# EAGLE design damp_v0002 (EAGLE 6.4)

## Sheet 1 of 2: DAC
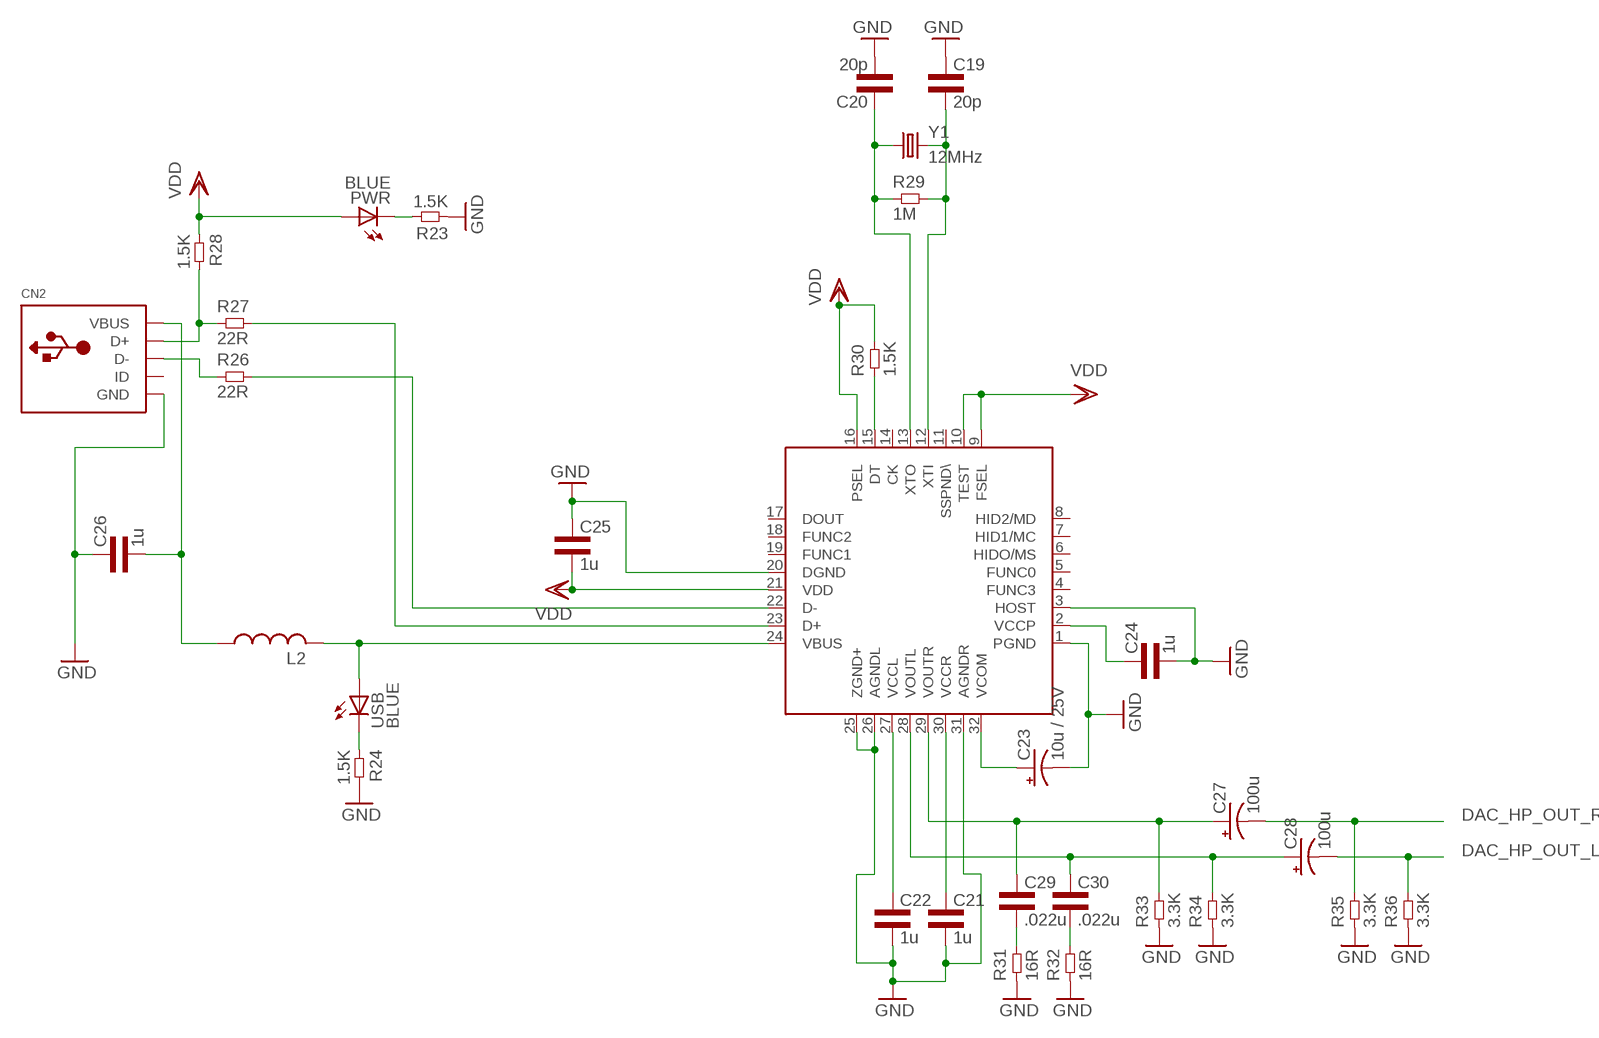
[diagram p0: schematic, sheet 1]

### Parts
C19  20p  CAP0603L3  [0603L3]
C20  20p  CAP0603L3  [0603L3]
C21  1u  CAP0603L3  [0603L3]
C22  1u  CAP0603L3  [0603L3]
C23  10u / 25V  CPOL-USE1.8-4  [E1,8-4]
C24  1u  CAP0603L3  [0603L3]
C25  1u  CAP0603L3  [0603L3]
C26  1u  CAP0603L3  [0603L3]
C27  100u  CPOL-USE2-5  [E2-5]
C28  100u  CPOL-USE2-5  [E2-5]
C29  .022u  CAP0603L3  [0603L3]
C30  .022u  CAP0603L3  [0603L3]
CN2  USBMINIB  [USB-MINIB]
L2  RCL_L-USL3225M  [RCL_L3225M]
PWR  BLUE  LED-BLUE0603  [LED-0603]
R23  1.5K  RES0603L3  [0603L3]
R24  1.5K  RES0603L3  [0603L3]
R26  22R  RES0603L3  [0603L3]
R27  22R  RES0603L3  [0603L3]
R28  1.5K  RES0603L3  [0603L3]
R29  1M  RES0603L3  [0603L3]
R30  1.5K  RES0603L3  [0603L3]
R31  16R  RES0603L3  [0603L3]
R32  16R  RES0603L3  [0603L3]
R33  3.3K  RES0603L3  [0603L3]
R34  3.3K  RES0603L3  [0603L3]
R35  3.3K  RES0603L3  [0603L3]
R36  3.3K  RES0603L3  [0603L3]
U$1  PCM2707_V1_PCM2704C_PCM2707  [PCM2707_V1_PCM2704C_PCM2707]
USB  BLUE  LED-BLUE0603  [LED-0603]
Y1  12MHz  CRYSTALHC49US  [HC49US]

### Nets
DAC_HP_OUT_L: C28.- R36.P$2 ; also sheet 2
DAC_HP_OUT_R: C27.- R35.P$2 ; also sheet 2
GND: C19.P$1 C20.P$2 C21.P$2 C22.P$2 C23.- C24.P$2 C25.P$1 C26.P$1 CN2.GND R23.P$1 R24.P$2 R31.P$1 R32.P$1 R33.P$1 R34.P$1 R35.P$1 R36.P$1 U$1.1(PGND) U$1.3(HOST) U$1.20(DGND) U$1.25(ZGND+) U$1.26(AGNDL) U$1.31(AGNDR) ; also sheet 2
N$2: PWR.C R23.P$2
N$6: R24.P$1 USB.C
N$18: CN2.D+ R27.P$1 R28.P$2
N$21: CN2.D- R26.P$1
N$37: R27.P$2 U$1.23(D+)
N$42: R26.P$2 U$1.22(D-)
N$43: C20.P$1 R29.P$1 U$1.13(XTO) Y1.1
N$44: C19.P$2 R29.P$2 U$1.12(XTI) Y1.2
N$45: C22.P$1 U$1.27(VCCL)
N$50: C21.P$1 U$1.30(VCCR)
N$51: C23.+ U$1.32(VCOM)
N$52: C29.P$2 R31.P$2
N$53: C24.P$1 U$1.2(VCCP)
N$54: C27.+ C29.P$1 R33.P$2 U$1.29(VOUTR)
N$55: L2.2 U$1.24(VBUS) USB.A
N$56: C26.P$2 CN2.VBUS L2.1
N$57: C28.+ C30.P$1 R34.P$2 U$1.28(VOUTL)
N$58: R30.P$1 U$1.15(DT)
N$59: C30.P$2 R32.P$2
VDD: C25.P$2 PWR.A R28.P$1 R30.P$2 U$1.9(FSEL) U$1.10(TEST) U$1.16(PSEL) U$1.21(VDD)
Unconnected: CN2.ID U$1.4(FUNC3) U$1.5(FUNC0) U$1.6(HIDO/MS) U$1.7(HID1/MC) U$1.8(HID2/MD) U$1.11(SSPND\) U$1.14(CK) U$1.17(DOUT) U$1.18(FUNC2) U$1.19(FUNC1)

## Sheet 2 of 2: Amp
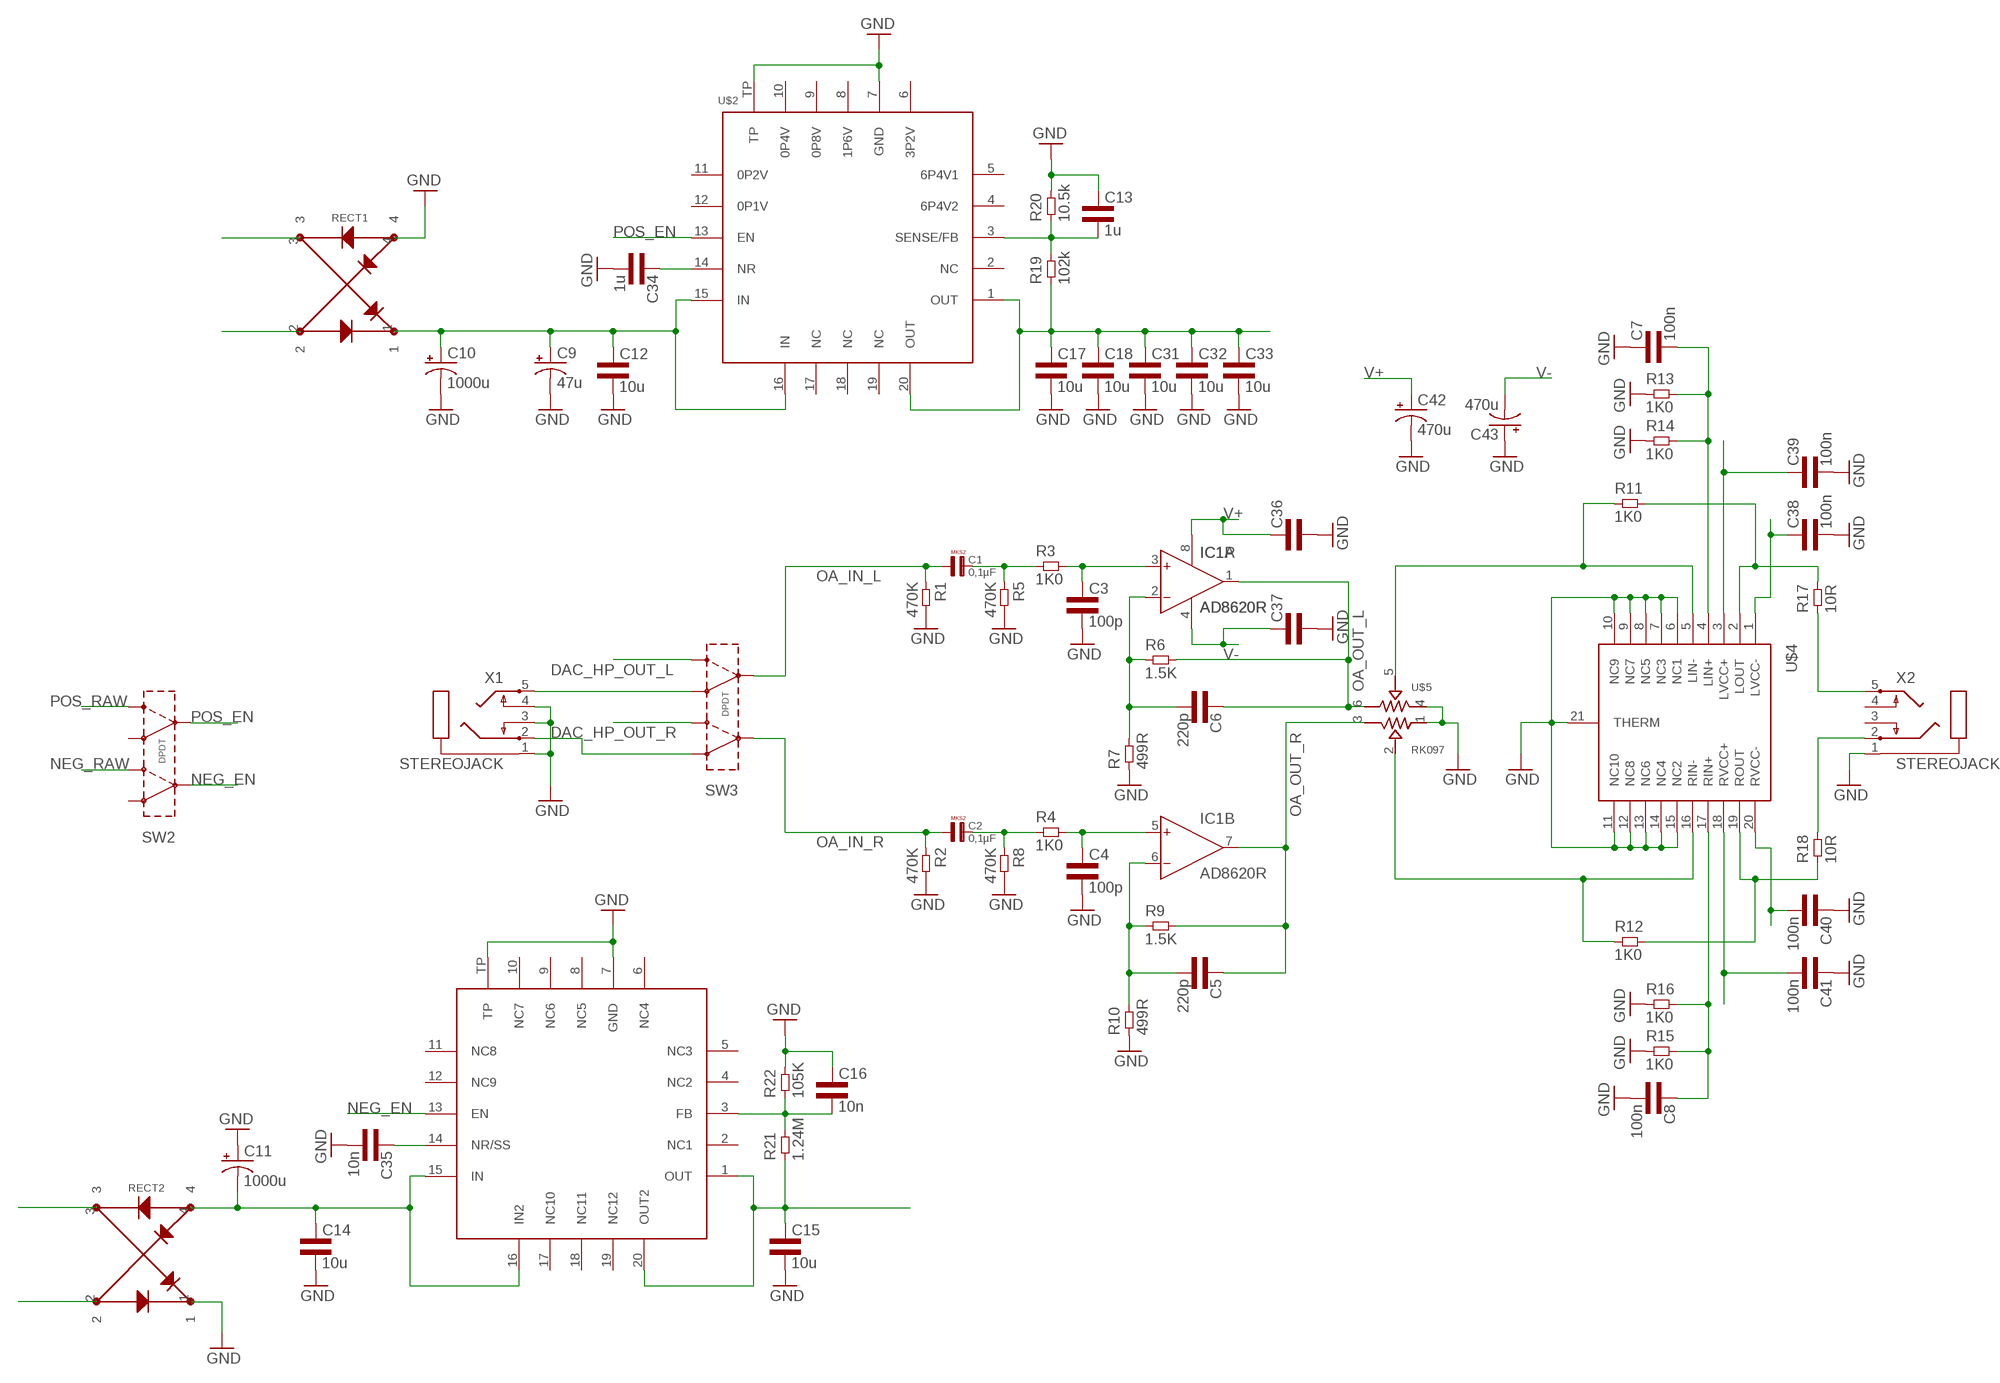
[diagram p1: schematic, sheet 2]

### Parts
C1  0,1µF  [R5B2K5]
C2  0,1µF  [R5B2K5]
C3  100p  CAP0603L3  [0603L3]
C4  100p  CAP0603L3  [0603L3]
C5  220p  CAP0603L3  [0603L3]
C6  220p  CAP0603L3  [0603L3]
C7  100n  CAP0603L3  [0603L3]
C8  100n  CAP0603L3  [0603L3]
C9  47u  CPOL-USCT7343  [CT7343]
C10  1000u  CPOL-USE7.5-16  [E7,5-16]
C11  1000u  CPOL-USE7.5-16  [E7,5-16]
C12  10u  CAP0805L3  [0805L3]
C13  1u  CAP0603L3  [0603L3]
C14  10u  CAP0805L3  [0805L3]
C15  10u  CAP0805L3  [0805L3]
C16  10n  CAP0603L3  [0603L3]
C17  10u  CAP0805L3  [0805L3]
C18  10u  CAP0805L3  [0805L3]
C31  10u  CAP0805L3  [0805L3]
C32  10u  CAP0805L3  [0805L3]
C33  10u  CAP0805L3  [0805L3]
C34  1u  CAP0603L3  [0603L3]
C35  10n  CAP0603L3  [0603L3]
C36  CAP0603L3  [0603L3]
C37  CAP0603L3  [0603L3]
C38  100n  CAP0603L3  [0603L3]
C39  100n  CAP0603L3  [0603L3]
C40  100n  CAP0603L3  [0603L3]
C41  100n  CAP0603L3  [0603L3]
C42  470u  CPOL-USE5-10.5  [E5-10,5]
C43  470u  CPOL-USE5-10.5  [E5-10,5]
IC1  AD8620R  [SO8]
R1  470K  RES0603L3  [0603L3]
R2  470K  RES0603L3  [0603L3]
R3  1K0  RES0603L3  [0603L3]
R4  1K0  RES0603L3  [0603L3]
R5  470K  RES0603L3  [0603L3]
R6  1.5K  RES0603L3  [0603L3]
R7  499R  RES0603L3  [0603L3]
R8  470K  RES0603L3  [0603L3]
R9  1.5K  RES0603L3  [0603L3]
R10  499R  RES0603L3  [0603L3]
R11  1K0  RES0603L3  [0603L3]
R12  1K0  RES0603L3  [0603L3]
R13  1K0  RES0603L3  [0603L3]
R14  1K0  RES0603L3  [0603L3]
R15  1K0  RES0603L3  [0603L3]
R16  1K0  RES0603L3  [0603L3]
R17  10R  RES1206L3  [1206L3]
R18  10R  RES1206L3  [1206L3]
R19  102k  RES0603L3  [0603L3]
R20  10.5k  RES0603L3  [0603L3]
R21  1.24M  RES0603L3  [0603L3]
R22  105K  RES0603L3  [0603L3]
RECT1  RECTIFIER_Z4GP206  [RECTIFIER_ABS-4]
RECT2  RECTIFIER_Z4GP206  [RECTIFIER_ABS-4]
SW2  DPDTCAS-A  [CAS-A]
SW3  DPDTCAS-A  [CAS-A]
U$2  POWER-SUPPLY_POS_V1_TI_LDO_TPS7A4700  [POWER-SUPPLY_POS_V1_TI_LDO_VQFN-20]
U$3  POWER-SUPPLY_POS_V1_TI_LDO_TPS7A3301RGWT  [POWER-SUPPLY_POS_V1_TI_LDO_VQFN-20]
U$4  PCM2707_V1_AMP_TPA6120_TPA6120  [PCM2707_V1_AMP_TPA6120_TPA6120]
U$5  RK097  [RK097]
X1  STEREOJACK  [STX3100]
X2  STEREOJACK  [STX3100]

### Nets
AC1: RECT1.3
AC2: RECT1.2
AC3: RECT2.3
AC4: RECT2.2
DAC_HP_OUT_L: SW3.P$6(OUTB2) ; also sheet 1
DAC_HP_OUT_R: SW3.P$3(OUTA2) ; also sheet 1
GND: C3.P$2 C4.P$2 C7.P$1 C8.P$2 C9.- C10.- C11.+ C12.2 C13.P$1 C14.2 C15.2 C16.P$1 C17.2 C18.2 C31.2 C32.2 C33.2 C34.P$2 C35.P$2 C36.P$2 C37.P$2 C38.P$2 C39.P$2 C40.P$1 C41.P$1 C42.- C43.+ R1.P$2 R2.P$2 R5.P$2 R7.P$1 R8.P$2 R10.P$1 R13.P$1 R14.P$1 R15.P$1 R16.P$1 R20.P$2 R22.P$2 RECT1.4 RECT2.1 U$2.7(GND) U$2.TP U$3.7(GND) U$3.TP U$4.6(NC1) U$4.7(NC3) U$4.8(NC5) U$4.9(NC7) U$4.10(NC9) U$4.11(NC10) U$4.12(NC8) U$4.13(NC6) U$4.14(NC4) U$4.15(NC2) U$4.21(THERM) U$5.1 U$5.4 X1.1 X1.3 X1.4 X2.1 ; also sheet 1
N$1: SW3.P$4(OUTB1) X1.5
N$3: SW3.P$1(OUTA1) X1.2
N$4: C34.P$1 U$2.14(NR)
N$7: C1.2 R3.P$1 R5.P$1
N$8: C3.P$1 IC1.3(A:IN+) R3.P$2
N$9: C6.P$2 IC1.2(A:IN-) R6.P$1 R7.P$2
N$10: R11.P$1 U$4.5(LIN-) U$5.5
N$11: R12.P$1 U$4.16(RIN-) U$5.2
N$12: C2.2 R4.P$1 R8.P$1
N$13: C4.P$1 IC1.5(B:IN+) R4.P$2
N$14: R11.P$2 R17.2 U$4.2(LOUT)
N$15: C5.P$2 IC1.6(B:IN-) R9.P$1 R10.P$2
N$16: R12.P$2 R18.1 U$4.19(ROUT)
N$17: C7.P$2 R13.P$2 R14.P$2 U$4.4(LIN+)
N$19: C8.P$1 R15.P$2 R16.P$2 U$4.17(RIN+)
N$20: R17.1 X2.5
N$22: R18.2 X2.2
N$23: C13.P$2 R19.P$2 R20.P$1 U$2.3(SENSE/FB)
N$24: C16.P$2 R21.P$2 R22.P$1 U$3.3(FB)
N$25: C35.P$1 U$3.14(NR/SS)
NEG_EN: SW2.P$2(INA) U$3.13(EN)
NEG_RAW: C11.- C14.1 RECT2.4 SW2.P$3(OUTA2) U$3.15(IN) U$3.16(IN2)
OA_IN_L: C1.1 R1.P$1 SW3.P$5(INB)
OA_IN_R: C2.1 R2.P$1 SW3.P$2(INA)
OA_OUT_L: C6.P$1 IC1.1(A:OUT) R6.P$2 U$5.6
OA_OUT_R: C5.P$1 IC1.7(B:OUT) R9.P$2 U$5.3
POS_EN: SW2.P$5(INB) U$2.13(EN)
POS_RAW: C9.+ C10.+ C12.1 RECT1.1 SW2.P$6(OUTB2) U$2.15(IN) U$2.16(IN)
V+: C17.1 C18.1 C31.1 C32.1 C33.1 C36.P$1 C39.P$1 C41.P$2 C42.+ IC1.8(P:V+) R19.P$1 U$2.1(OUT) U$2.20(OUT) U$4.3(LVCC+) U$4.18(RVCC+)
V-: C15.1 C37.P$1 C38.P$1 C40.P$2 C43.- IC1.4(P:V-) R21.P$1 U$3.1(OUT) U$3.20(OUT2) U$4.1(LVCC-) U$4.20(RVCC-)
Unconnected: SW2.P$1(OUTA1) SW2.P$4(OUTB1) U$2.2(NC) U$2.4(6P4V2) U$2.5(6P4V1) U$2.6(3P2V) U$2.8(1P6V) U$2.9(0P8V) U$2.10(0P4V) U$2.11(0P2V) U$2.12(0P1V) U$2.17(NC) U$2.18(NC) U$2.19(NC) U$3.2(NC1) U$3.4(NC2) U$3.5(NC3) U$3.6(NC4) U$3.8(NC5) U$3.9(NC6) U$3.10(NC7) U$3.11(NC8) U$3.12(NC9) U$3.17(NC10) U$3.18(NC11) U$3.19(NC12) X2.3 X2.4

## Library data of the parts
C1 C2 = Capacitor-Wima-MKS2-63v:0,1µF
C3-C8 C12-C22 C24-C26 C29-C41 = common:CAP
C9-C11 C23 C27 C28 C42 C43 = rcl:CPOL-US: POLARIZED CAPACITOR, American symbol
CN2 = adafruit:USB: USB Connectors USBMINIB - Surface Mount Female Mini-B USB Connector 4UConnector: 06564 By microbuilder.eu Thru-hole RA Female Mini-B USB Connector 4UConnector: 18732 By ladyada.net
IC1 = analog-devices:AD8620: Precision, Very Low Noise, Low Input Bias Current, Wide Bandwidth JFET Operational Amplifiers Source: http://www.analog.com/static/imported-files/data_sheets/AD8610_8620.pdf; MF: ALTERA CORPORATION; MPN: AD8620ARZ; OC_FARNELL: 9994386; OC_NEWARK: 59K6972
L2 = pcm2707_v1:RCL_L-US: INDUCTOR, American symbol
PWR USB = SparkFun-LED:LED-BLUE: Blue LEDs for production use Various blue LEDs stocked by SparkFun production 0603 - DIO-08575 Rebel - DIO-09553 1206 - DIO-09911; PROD_ID: DIO-08575
R1-R24 R26-R36 = common:RES
RECT1 RECT2 = my_dac_amp:RECTIFIER_Z4GP206
SW2 SW3 = common:DPDT
U$1 = my_dac_amp:PCM2707_V1_PCM2704C_PCM2707: Upgraded version of the PCM2704. It allows connecting to a device with USB and transmitting that data to another DAC using I2S protocol. Also has other advanced features that allow control with SPI, external buttons, etc.
U$2 = my_dac_amp:POWER-SUPPLY_POS_V1_TI_LDO_TPS7A4700
U$3 = my_dac_amp:POWER-SUPPLY_POS_V1_TI_LDO_TPS7A3301RGWT: Ultra-Low Noise NEGATIVE Voltage Reglator
U$4 = my_dac_amp:PCM2707_V1_AMP_TPA6120_TPA6120
U$5 = SparkFun-Electromechanical:RK097
X1 X2 = adafruit:STEREOJACK: MIC/HEADPHONE JACK Stereo jack with two switches. Kycon STX3100, CUI SJ1-3555NG and/or 4UCon 05544
Y1 = SparkFun-FreqCtrl:CRYSTAL: Various standard crystals. Proven footprints. Spark Fun Electronics SKU : COM-00534

## Board
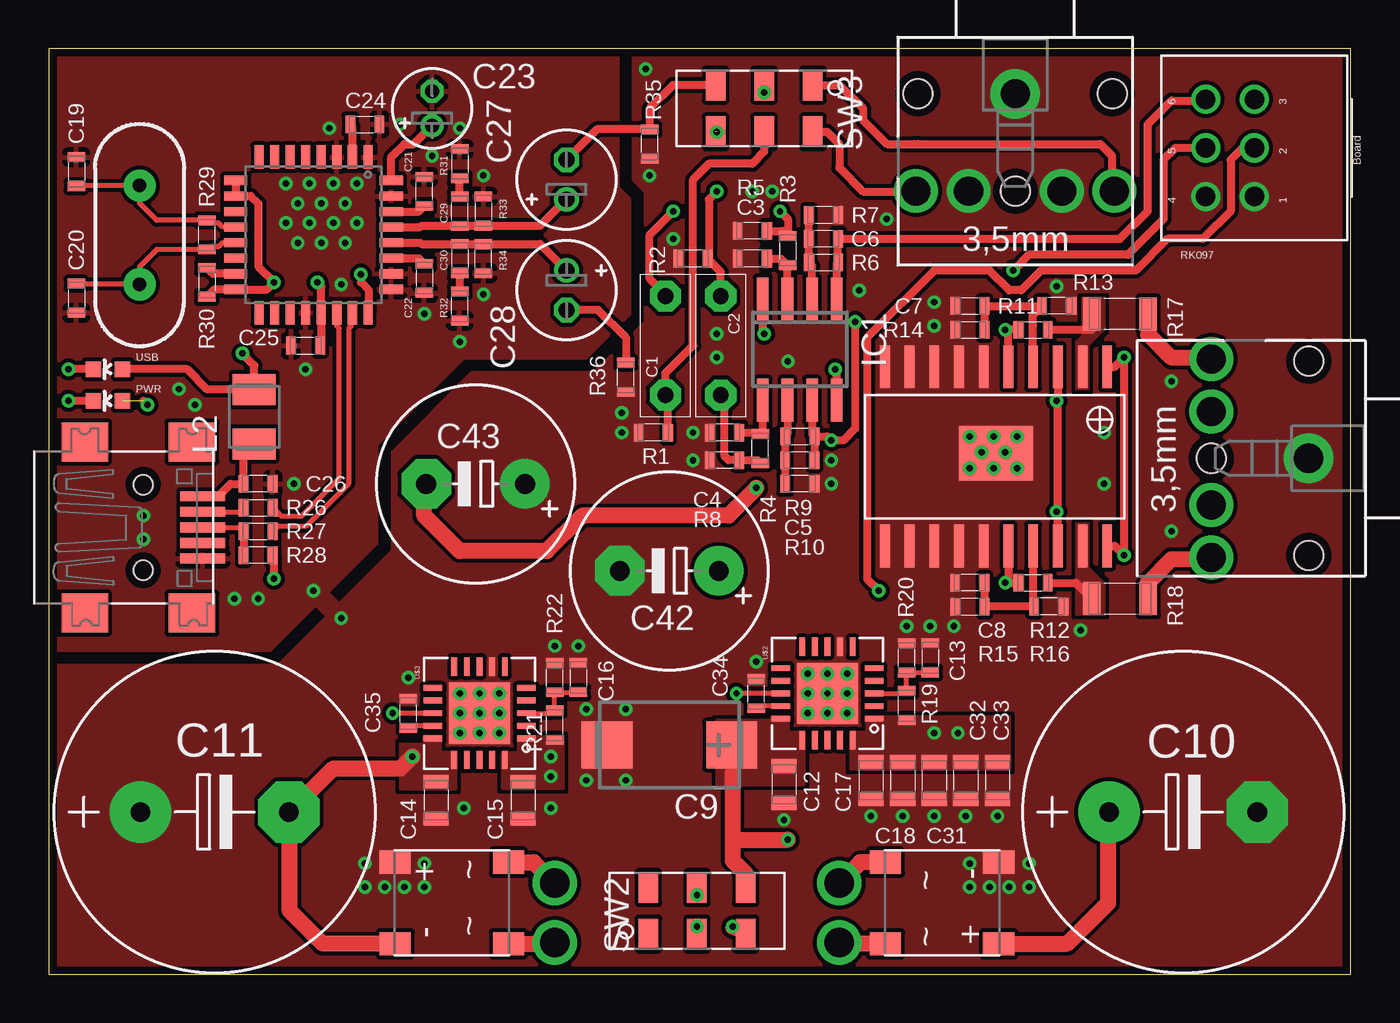
[diagram p2: board, top side]
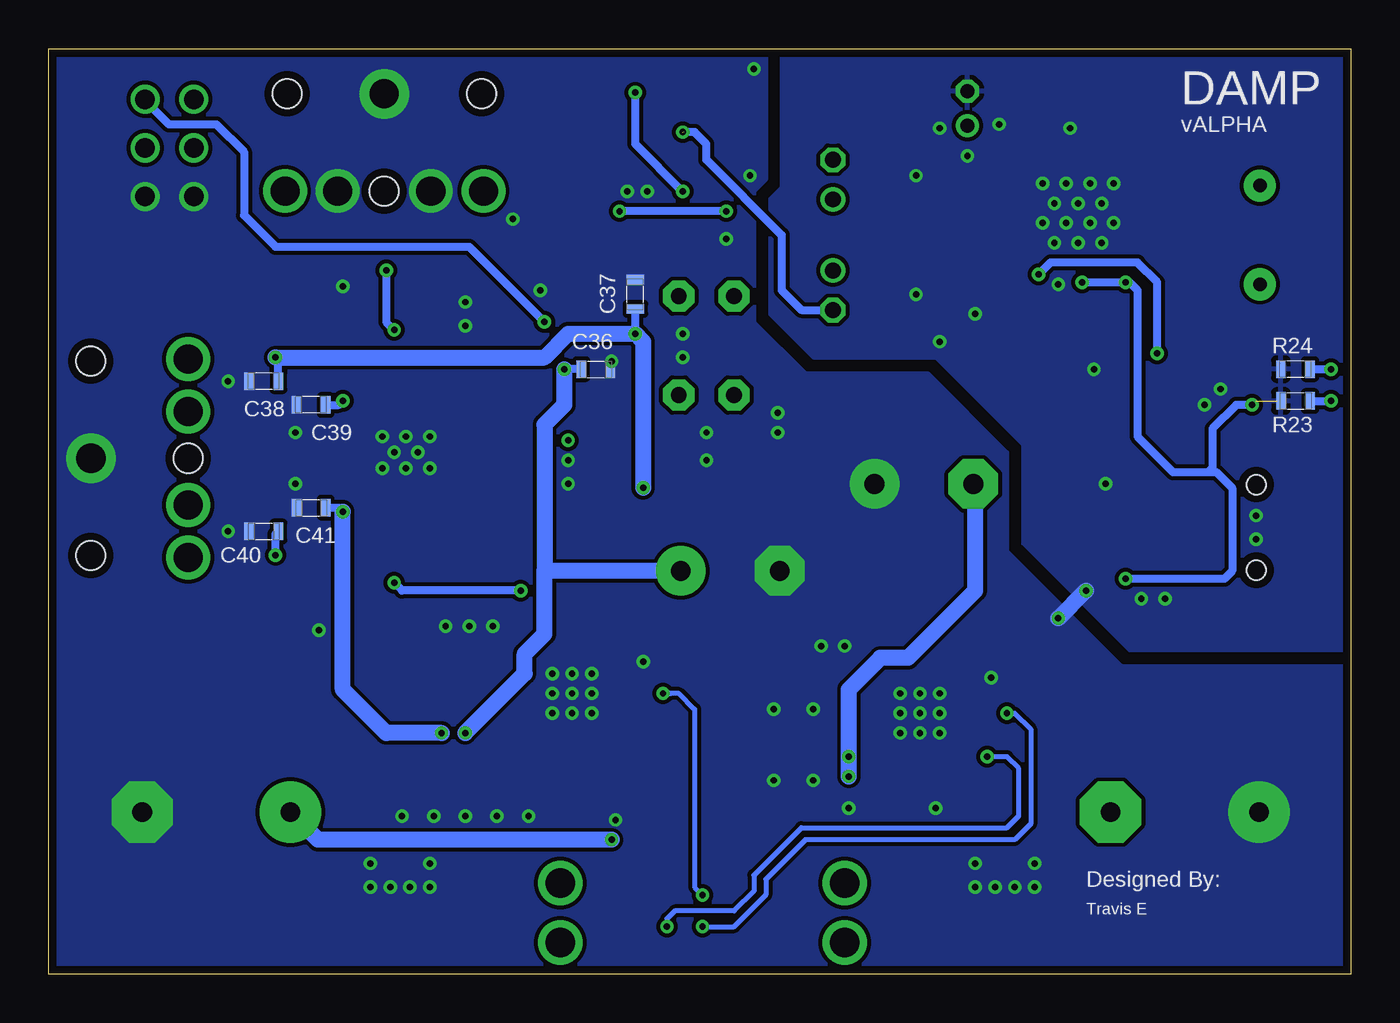
[diagram p3: board, bottom side, seen from below]

Size 66.93 x 47.57 mm. Coordinates in mm from the lower left corner, seen from the top.
Outline: 0,0 66.93,0 66.93,47.57 0,47.57 0,0
Copper layers (1*16): Top 0.035mm / dielectric 1.5mm / Bottom 0.035mm
Design rules "default *": minimum track width 8mil, minimum drill 13mil, track to track 8mil, track to pad 8mil, pad to pad 8mil, via to via 8mil, smd to smd 8mil, copper to edge 16mil, drill to drill 8mil, minimum pad ring 7mil, minimum via ring 7mil, stop-mask expansion 4mil, vias tented up to drill 18mil, thermal gap 10mil

### Footprints (pad centres in the part's own frame; a part is rotated, then mirrored left to right if it is on the bottom)
R5B2K5 = drill 0.813 pad 1.6 octagon: 1 -2.54,0; 2 2.54,0
0603L3 = smd 0.5 x 0.9: P$1 -0.75,0; P$2 0.75,0
CT7343 = smd 2.6 x 2.4: + -3.2,0; - 3.2,0
E7,5-16 = drill 1.016 pad 3.15: + -3.81,0 | drill 1.016 pad 3.15 octagon: - 3.81,0
0805L3 = smd 0.7 x 1.3: 1 -0.95,0; 2 0.95,0
E1,8-4 = drill 0.711 pad 1.168: + -0.889,0 | drill 0.711 pad 1.168 octagon: - 0.889,0
E2-5 = drill 0.813 pad 1.27: + -1.016,0 | drill 0.813 pad 1.27 octagon: - 1.016,0
E5-10,5 = drill 1.016 pad 2.54: + -2.54,0 | drill 1.016 pad 2.54 octagon: - 2.54,0
USB-MINIB = smd 0.5 x 2.308: D+ 0,4.064; D- -0.8,4.064; GND 1.6,4.064; ID 0.8,4.064; VBUS -1.6,4.064 | smd 2 x 2.4: GND1 -4.4,-2; GND2 -4.4,3.5; GND3 4.4,3.5; GND4 4.4,-2 | hole 1: -2.2,1; 2.2,1
SO8 = smd 0.6 x 2.2: 1 -1.905,-2.6; 2 -0.635,-2.6; 3 0.635,-2.6; 4 1.905,-2.6; 5 1.905,2.6; 6 0.635,2.6; 7 -0.635,2.6; 8 -1.905,2.6
RCL_L3225M = smd 1.6 x 2.2: 1 -1.4,0; 2 1.4,0
LED-0603 = smd 0.8 x 0.8: A 0,-0.75; C 0,0.75
1206L3 = smd 0.9 x 1.7: 1 -1.45,0; 2 1.45,0
RECTIFIER_ABS-4 = smd 1.2 x 1.6: 1 2.1,2.91; 2 2.1,-2.91; 3 -2.1,-2.91; 4 -2.1,2.91
CAS-A = smd 1 x 1.6: P$1 -2.5,-1.2; P$2 0,-1.2; P$3 2.5,-1.2; P$4 -2.5,1.2; P$5 0,1.2; P$6 2.5,1.2
PCM2707_V1_PCM2704C_PCM2707 = smd 0.47 x 1.2: 1 -2.8,-4; 2 -2,-4; 3 -1.2,-4; 4 -0.4,-4; 5 0.4,-4; 6 1.2,-4; 7 2,-4; 8 2.8,-4; 17 2.8,4; 18 2,4; 19 1.2,4; 20 0.4,4; 21 -0.4,4; 22 -1.2,4; 23 -2,4; 24 -2.8,4 | smd 1.2 x 0.47: 9 4,-2.8; 10 4,-2; 11 4,-1.2; 12 4,-0.4; 13 4,0.4; 14 4,1.2; 15 4,2; 16 4,2.8; 25 -4,2.8; 26 -4,2; 27 -4,1.2; 28 -4,0.4; 29 -4,-0.4; 30 -4,-1.2; 31 -4,-2; 32 -4,-2.8
POWER-SUPPLY_POS_V1_TI_LDO_VQFN-20 = smd 0.3 x 0.95: 1 -1.3,-2.4; 2 -0.65,-2.4; 3 0,-2.4; 4 0.65,-2.4; 5 1.3,-2.4; 11 1.3,2.4; 12 0.65,2.4; 13 0,2.4; 14 -0.65,2.4; 15 -1.3,2.4 | smd 0.95 x 0.3: 6 2.4,-1.3; 7 2.4,-0.65; 8 2.4,0; 9 2.4,0.65; 10 2.4,1.3; 16 -2.4,1.3; 17 -2.4,0.65; 18 -2.4,0; 19 -2.4,-0.65; 20 -2.4,-1.3 | smd 3.15 x 3.15: TP 0,0
PCM2707_V1_AMP_TPA6120_TPA6120 = smd 0.5 x 2.2: 1 0.25,1.095; 2 1.52,1.095; 3 2.79,1.095; 4 4.06,1.095; 5 5.33,1.095; 6 6.6,1.095; 7 7.87,1.095; 8 9.14,1.095; 9 10.41,1.095; 10 11.68,1.095; 11 11.68,10.295; 12 10.41,10.295; 13 9.14,10.295; 14 7.87,10.295; 15 6.6,10.295; 16 5.33,10.295; 17 4.06,10.295; 18 2.79,10.295; 19 1.52,10.295; 20 0.25,10.295 | smd 3.81 x 2.79: 21 5.965,5.54
RK097 = drill 1: 1 2.5,0; 2 0,0; 3 -2.5,0; 4 2.5,-2.5; 5 0,-2.5; 6 -2.5,-2.5
STX3100 = drill 1.5 pad 2.54: 1 2.7,-0.1 | drill 1.5: 2 7.7,5; 3 7.7,2.3; 4 7.7,-2.5; 5 7.7,-5.2 | hole 1.5: 2.7,4.9; 2.7,-5.1; 7.7,-0.1
HC49US = drill 0.7 pad 1.651: 1 -2.54,0; 2 2.54,0

### Placement (x,y rotation side)
C1  31.7,32.31 90 top
C2  34.54,32.31 270 top
C3  36.17,36.78 180 top
C4  34.75,27.84 180 top
C5  38.61,26.42 180 top
C6  39.83,37.8 180 top
C7  47.35,34.34 0 top
C8  47.35,20.12 180 top
C9  31.9,11.79 180 top
C10  58.32,8.33 0 top
C11  8.53,8.33 0 top
C12  37.8,9.75 270 top
C13  45.31,16.26 270 top
C14  19.91,8.94 270 top
C15  24.38,8.94 270 top
C16  27.23,15.24 270 top
C17  42.27,9.96 270 top
C18  43.89,9.96 270 top
C19  1.42,41.25 270 top
C20  1.42,34.75 270 top
C21  19.3,40.23 90 top
C22  19.3,35.76 270 top
C23  19.71,44.5 90 top
C24  16.26,43.69 0 top
C25  13.21,32.31 0 top
C26  10.77,25.2 180 top
C27  26.62,40.84 90 top
C28  26.62,35.15 270 top
C29  21.13,39.22 90 top
C30  21.13,36.78 270 top
C31  45.52,9.96 270 top
C32  47.14,9.96 270 top
C33  48.77,9.96 270 top
C34  36.37,14.43 90 top
C35  18.49,13.41 90 top
C36  38.81,31.09 0 bottom
C37  36.78,34.95 90 bottom
C38  55.88,30.48 180 bottom
C39  53.44,29.26 180 bottom
C40  55.88,22.76 0 bottom
C41  53.44,23.98 0 bottom
C42  31.9,20.73 180 top
C43  21.95,25.2 180 top
CN2  3.86,22.96 270 top
IC1  38.61,32.11 180 top
L2  10.57,28.65 90 top
PWR  3.05,29.46 90 top
R1  31.09,27.84 180 top
R2  33.12,36.78 180 top
R3  38,37.19 270 top
R4  36.58,27.03 90 top
R5  36.17,38.2 180 top
R6  39.83,36.58 0 top
R7  39.83,39.01 180 top
R8  34.75,26.42 180 top
R9  38.61,27.64 0 top
R10  38.61,25.2 180 top
R11  50.6,33.12 0 top
R12  50.6,20.12 0 top
R13  51.82,34.34 180 top
R14  47.35,33.12 0 top
R15  47.35,18.9 0 top
R16  51.41,18.9 180 top
R17  55.07,33.93 180 top
R18  55.07,19.3 0 top
R19  44.09,13.82 90 top
R20  44.09,16.26 90 top
R21  26.01,12.8 90 top
R22  26.01,15.24 90 top
R23  2.84,29.46 0 bottom
R24  2.84,31.09 180 bottom
R26  10.77,23.98 0 top
R27  10.77,22.76 0 top
R28  10.77,21.54 180 top
R29  8.13,38 90 top
R30  8.13,35.56 270 top
R31  21.13,41.66 270 top
R32  21.13,34.34 90 top
R33  22.35,39.22 270 top
R34  22.35,36.78 90 top
R35  30.89,42.67 90 top
R36  29.67,30.68 90 top
RECT1  45.92,3.66 270 top
RECT2  20.73,3.66 90 top
SW2  33.32,3.25 0 top
SW3  36.78,44.5 180 top
U$1  13.61,38 180 top
U$2  40.03,14.43 90 top
U$3  22.15,13.41 90 top
U$4  54.66,32.31 180 top
U$5  61.98,42.47 270 top
USB  3.05,31.09 90 top
X1  49.78,47.96 270 top
X2  67.46,26.42 180 top
Y1  4.67,38 90 top

### Tracks (layer width: path | path; a pad name or v marks a point on that pad's centre or on a via)
AC1  (via drill 1.52)
  Top 0.813: RECT1.3 41.72,5.76 v40.64,4.67
AC2  (via drill 1.52)
  Top 0.813: RECT1.2 40.71,1.56 v40.64,1.63
AC3  (via drill 1.52)
  Top 0.813: RECT2.3 25.94,1.56 v26.01,1.63
AC4  (via drill 1.52)
  Top 0.813: RECT2.2 24.93,5.76 v26.01,4.67
DAC_HP_OUT_L  (via drill 0.33)  (1 unrouted)
  Top 0.406: R36.P$2 29.67,32.72 28.25,34.14 C28.-
  Bottom 0.406: C28.- 28.25,34.14 29.26,35.15 29.26,38 33.12,41.86 33.12,42.67 33.73,43.28 v34.34,43.28
DAC_HP_OUT_R
  Top 0.406: C27.- 28.18,43.42 R35.P$2 30.89,44.5 32.09,45.7 SW3.P$3
GND  (via drill 0.33)
  Bottom 0.813: v13.61,19.71 v15.04,18.29
  other vias: 26.01,16.87 27.23,16.87 25.81,8.53 21.34,8.53 29.46,27.84 33.12,27.84 33.12,26.42 40.23,26.42 40.23,25.2 36.37,16.05 44.09,17.88 45.31,17.88 37.8,7.92 42.27,8.13 43.89,8.13 45.52,8.13 47.14,8.13 48.77,8.13 29.46,28.85 36.17,40.23 37.19,40.23 18.08,43.69 19.71,42.06 21.13,43.48 22.35,41.05 22.35,34.95 21.13,32.51 19.3,33.93 13.21,31.09 12.6,25.2 46.53,17.88 45.52,34.54 45.52,33.32 51.82,35.36 53.04,17.68 30.89,41.05 43.08,38.81 32.11,37.8 57.71,22.76 57.71,30.48 54.25,27.84 54.25,25.2 16.26,5.69 19.3,5.69 47.35,5.69 50.39,5.69 18.49,15.24 12.19,40.64 13.41,40.64 14.63,40.64 15.85,40.64 12.8,39.62 14.02,39.62 15.24,39.62 15.85,38.61 14.63,38.61 13.41,38.61 12.19,38.61 12.8,37.59 14.02,37.59 15.24,37.59 47.35,27.64 47.35,26.01 47.96,26.82 48.56,27.64 48.56,26.01 49.17,26.82 49.78,27.64 49.78,26.01 39.01,15.44 41.05,15.44 40.03,15.44 39.01,14.43 40.03,14.43 41.05,14.43 39.01,13.41 40.03,13.41 41.05,13.41 21.13,14.43 22.15,14.43 23.16,14.43 22.15,13.41 22.15,12.4 21.13,13.41 23.16,13.41 23.16,12.4 21.13,12.4 15.04,35.46 27.64,9.96 29.67,9.96 27.64,13.61 29.67,13.61 14.43,43.48 6.71,30.07 7.52,29.26 4.88,22.35 4.88,23.57 9.55,19.3 10.77,19.3 38,31.5 34.34,32.92 34.34,31.7 16.26,4.47 19.3,4.47 17.27,4.47 18.29,4.47 47.35,4.47 50.39,4.47 48.36,4.47 49.38,4.47 30.68,46.53 41.66,35.15
  pour Top (rank 6): 0.41,16.66 11.38,16.66 16.87,22.15 16.87,27.23 21.34,31.7 27.64,31.7 29.87,33.93 29.87,39.83 29.26,40.44 29.26,47.14 0.41,47.14
  pour Bottom: 29.26,47.14 29.26,40.44 29.87,39.83 29.87,33.93 27.64,31.7 21.34,31.7 16.87,27.23 16.87,22.15 11.38,16.66 0.41,16.66 0.41,47.14
  pour Bottom (no thermals): 30.07,47.14 30.07,40.84 30.68,40.23 30.68,33.53 28.04,30.89 21.74,30.89 17.68,26.82 17.68,21.74 11.79,15.85 0.41,15.85 0.41,0.41 66.45,0.41 66.45,47.14
  pour Top (rank 6, no thermals): 30.07,47.14 30.07,40.84 30.68,40.23 30.68,33.53 28.04,30.89 21.74,30.89 17.68,26.82 17.68,21.74 11.79,15.85 0.41,15.85 0.41,0.41 66.45,0.41 66.45,47.14
  pour Top: 15.04,17.68 15.44,17.68 15.65,17.88 15.65,18.29 15.04,18.9 13.61,20.32 13.21,20.32 13,20.12 13,19.71
N$1
  Top 0.406: X1.5 44.56,40.23 41.86,40.23 40.64,41.45 40.64,42.67 40.01,43.3 SW3.P$4
N$2  (via drill 0.33)
  Top 0.406: PWR.C v1.02,29.46
  Bottom 0.406: R23.P$2 v1.02,29.46
N$3
  Top 0.406: X1.2 54.66,40.38 54.66,42.06 54.05,42.67 44.7,42.67 44.5,42.67 43.08,42.67 41.86,43.89 41.86,44.5 40.66,45.7 SW3.P$1
N$4
  Top 0.254: U$2.14 36.47,13.78 C34.P$1
N$6  (via drill 0.33)
  Top 0.406: USB.C v1.02,31.09
  Bottom 0.406: R24.P$1 v1.02,31.09
N$7  (via drill 0.33)
  Top 0.406: R5.P$1 37.73,38.2 R3.P$1 38,38.81 v37.59,39.22 | C1.2 31.7,34.95 30.89,35.76 30.89,38 v32.11,39.22
  Bottom 0.406: v32.11,39.22 v37.59,39.22
N$8
  Top 0.406: IC1.3 37.97,36.41 R3.P$2 37.66,36.78 C3.P$1
N$9
  Top 0.406: IC1.2 39.24,36.41 R6.P$1 C6.P$2 R7.P$2
N$10  (via drill 0.33)
  Top 0.406: U$5.5 57.91,42.47 57.3,41.86 57.3,38.81 55.47,36.98 50.39,36.98 v49.58,36.17 | R11.P$1 v49.17,33.12 49.33,32.97 U$4.5
  Bottom 0.406: v49.58,36.17 49.58,33.53 v49.17,33.12
N$11  (via drill 0.33)
  Top 0.406: U$4.16 49.33,20.27 v49.17,20.12 R12.P$1 | U$5.2 61.37,42.47 60.76,41.86 60.76,39.22 59.33,37.8 57.51,37.8 55.88,36.17 51,36.17 49.99,35.15 49.38,35.15 48.36,36.17 45.52,36.17 42.06,32.72 42.06,20.32 v42.67,19.71
  Bottom 0.406: v42.67,19.71 48.77,19.71 v49.17,20.12
N$12
  Top 0.406: R4.P$1 36.44,26.42 R8.P$1 34.95,26.42 34.75,26.62 34.75,29.57 C2.2
N$13
  Top 0.406: IC1.5 36.7,27.9 R4.P$2 36.51,27.84 C4.P$1
N$14
  Top 0.406: R11.P$2 53.62,33.12 R17.2
  pour Top (no thermals): 52.83,30.07 52.83,32.51 53.14,32.82 53.14,34.75 54.25,34.75 54.25,33.12 53.44,32.31 53.44,30.07
N$15
  Top 0.406: IC1.6 37.97,27.75 R9.P$1 C5.P$2 R10.P$2
N$16
  Top 0.406: R12.P$2 52.8,20.12 R18.1
  pour Top (no thermals): 52.83,23.16 52.83,18.49 54.25,18.49 54.25,20.12 53.44,20.93 53.44,23.16
N$17
  Top 0.406: U$4.4 50.6,33.32 50.6,33.87 R13.P$2 C7.P$2 R14.P$2
N$18
  Top 0.254: CN2.D+ 9.82,22.96 R27.P$1
  Top 0.406: R27.P$1 R28.P$2
N$19
  Top 0.406: C8.P$1 R15.P$2 R16.P$2 50.6,18.96 U$4.17
N$20
  Top 0.813: R17.1 56.52,32.89 57.71,31.7 59.68,31.7 X2.5
N$21
  Top 0.254: CN2.D- 9.8,23.76 R26.P$1
N$22
  Top 0.813: R18.2 56.52,20.14 57.71,21.34 59.74,21.34 59.74,21.39 X2.2
N$23
  Top 0.254: U$2.3 43.95,14.43 R19.P$2 R20.P$1 C13.P$2
N$24
  Top 0.254: U$3.3 25.87,13.41 R21.P$2 R22.P$1 C16.P$2
N$25
  Top 0.254: U$3.14 18.59,12.76 C35.P$1
N$37
  Top 0.254: U$1.23 15.57,33.95 15.57,33.32 15.44,33.2 15.44,25.22 13.26,23.04 11.8,23.04 R27.P$2
N$42
  Top 0.254: U$1.22 14.81,33.32 14.94,33.2 14.94,25.48 13.01,23.55 11.95,23.55 R26.P$2
N$43
  Top 0.254: U$1.13 8.95,37.6 8.74,37.39 8.27,37.39 R29.P$1 5.55,37.25 4.67,36.37 Y1.1 1.46,35.46 C20.P$1
N$44
  Top 0.254: U$1.12 8.95,38.4 8.74,38.61 8.27,38.61 R29.P$2 5.55,38.75 4.67,39.62 Y1.2 1.46,40.54 C19.P$2
N$45
  Top 0.406: U$1.27 19.02,36.8 C22.P$1
N$50
  Top 0.406: U$1.30 19.02,39.2 C21.P$1
N$51
  Top 0.406: U$1.32 17.61,42 18.29,42.67 18.77,42.67 C23.+
N$52
  Top 0.406: C29.P$2 R31.P$2
N$53
  Top 0.406: U$1.2 15.61,43.58 C24.P$1
N$54
  Top 0.406: U$1.29 19.1,38.4 19.16,38.47 C29.P$1 R33.P$2 25.26,38.47 C27.+
N$55  (via drill 0.33)
  Top 0.406: v9.96,31.9 10.57,31.29 L2.2 8.15,30.05 7.11,31.09 USB.A | v16.05,35.97 16.05,35.56 16.46,35.15 16.46,34.04 U$1.24
  Bottom 0.406: v9.96,31.9 9.96,35.56 10.97,36.58 15.44,36.58 v16.05,35.97
N$56
  Top 0.406: CN2.VBUS 8.71,24.56 9.35,25.2 C26.P$2 10.02,26.7 L2.1
N$57
  Top 0.406: U$1.28 19.1,37.59 19.16,37.53 C30.P$1 R34.P$2 25.26,37.53 C28.+
N$58
  Top 0.406: U$1.15 8.44,36 R30.P$1
N$59
  Top 0.406: C30.P$2 R32.P$2
NEG_EN  (via drill 0.33)
  Top 0.254: U$3.13 v17.68,13.41
  Top 0.61: SW2.P$2 v33.33,2.44
  Bottom 0.254: v17.68,13.41 17.27,13.41 16.46,12.6 16.46,7.72 17.27,6.91 28.04,6.91 30.07,4.88 30.07,4.06 31.7,2.44 v33.33,2.44
NEG_RAW  (via drill 0.33)
  Top 0.61: SW2.P$3 35.08,2.36 v35.15,2.44
  Top 0.813: v18.69,11.18 18.09,10.57 14.63,10.57 12.39,8.33 C11.- 12.39,8.28 12.39,3.25 14.09,1.56 RECT2.4
  Bottom 0.254: v18.69,11.18 17.68,11.18 17.07,10.57 17.07,8.13 17.68,7.52 28.25,7.52 30.68,5.08 30.68,4.27 31.7,3.25 34.75,3.25 35.15,2.84 v35.15,2.44
  pour Top (no thermals): 20.12,12.19 19.3,12.19 19.3,11.79 18.08,11.79 18.08,9.55 20.93,9.55 20.93,11.38 20.12,11.38
OA_IN_L
  Top 0.406: R1.P$1 31.84,29.63 C1.1 31.7,30.89 33.12,32.31 33.12,40.84 33.93,41.66 36.17,41.66 36.78,42.27 SW3.P$5
OA_IN_R  (via drill 0.33)
  Top 0.406: C2.1 34.54,36.11 R2.P$1 33.93,36.84 33.93,39.83 v34.34,40.23 | v36.78,45.31 SW3.P$2
  Bottom 0.406: v34.34,40.23 36.78,42.67 v36.78,45.31
OA_OUT_L
  Top 0.406: IC1.1 40.51,36.51 R6.P$2 C6.P$1 55.07,37.8 56.49,39.22 56.49,43.69 57.71,44.91 59.41,44.91 U$5.6
OA_OUT_R  (via drill 0.33)
  Top 0.406: IC1.7 39.24,27.75 R9.P$2 | R9.P$2 C5.P$1 | R9.P$2 40.03,27.64 v40.23,27.43 40.84,27.43 41.45,28.04 v41.45,33.53
  Bottom 0.406: U$5.3 61.98,44.91 60.76,43.69 58.32,43.69 56.9,42.27 56.9,39.01 55.27,37.39 45.31,37.39 v41.45,33.53
POS_EN  (via drill 0.33)
  Top 0.254: U$2.13 v35.36,14.43
  Top 0.61: SW2.P$5 v33.33,4.06
  Bottom 0.254: 34.95,14.43 v35.36,14.43 34.54,14.43 33.73,13.61 33.73,4.47 v33.33,4.06
POS_RAW  (via drill 0.33)
  Top 0.813: RECT1.1 52.36,1.56 54.46,3.66 54.46,8.28 C10.+ | 35.15,10.36 35.15,6.91 | 35.15,6.91 35.15,5.84 35.83,5.17 SW2.P$6 | 35.15,6.91 v38,6.91
  Bottom 0.813: v38,6.91 53.09,6.91 C10.+
  pour Top (no thermals): 37.19,13.21 37.19,13 34.34,13 34.34,10.97 34.34,9.75 38.81,9.75 38.81,12.4 38,12.4 38,13.21
V+  (via drill 0.33)
  Top 0.406: IC1.8 40.51,31.01 v40.44,31.09 | 51.87,23.72 51.87,29.41 v51.82,29.46 51.87,29.52 U$4.3 | U$4.18 51.87,23.72 | 51.87,23.72 v51.82,23.77
  Bottom 0.406: C41.P$2 52.02,23.98 v51.82,23.77 | C39.P$1 52.02,29.26 v51.82,29.46 | C36.P$1 v40.44,31.09
  Bottom 0.813: v46.74,12.4 49.58,12.4 51.82,14.63 v51.82,23.77 | v40.44,31.09 40.44,29.26 41.45,28.24 41.45,20.73 41.25,20.73 | C42.+ 41.25,20.73 | v45.52,12.4 42.47,15.44 42.47,16.46 41.45,17.48 41.45,20.52 41.25,20.73
  pour Top (no thermals): 42.06,13.21 42.06,12.4 41.25,12.4 41.25,10.57 49.38,10.57 49.38,13.21
V-  (via drill 0.33)
  Top 0.406: IC1.4 36.7,32.99 v36.78,32.92 | U$4.20 54.8,22.01 v55.27,21.54 v55.27,31.7 54.78,31.21 U$4.1
  Top 0.813: C43.- 19.3,25.1 19.3,23.57 21.13,21.74 25.6,21.74 27.43,23.57 34.95,23.57 v36.37,24.99
  Bottom 0.406: v55.27,21.54 55.27,22.62 C40.P$2 | v36.78,32.92 C37.P$1 | C38.P$1 55.13,31.56 v55.27,31.7
  Bottom 0.813: v55.27,31.7 41.45,31.7 40.23,32.92 v36.78,32.92 36.37,32.51 v36.37,24.99 | v25.81,10.16 25.81,14.63 24.18,16.26 22.76,16.26 19.3,19.71 19.3,25.1 C43.-
  other vias: 25.81,11.18
  pour Top (no thermals): 24.18,12.19 26.42,12.19 26.42,9.55 23.37,9.55 23.37,11.38 24.18,11.38
VDD  (via drill 0.33)  (1 unrouted)
  Top 0.406: C25.P$2 14.01,32.37 U$1.21 14.01,35.36 v13.82,35.56 | v11.58,20.32 11.58,21.48 R28.P$1 | U$1.9 U$1.10 10.39,40 10.77,39.62 10.77,36.37 v11.58,35.56 11.22,35.2 U$1.16 8.52,35.2 R30.P$2 | 4.88,29.46 v5.08,29.26
  Bottom 0.406: v13.82,35.56 v11.58,35.56 11.38,35.56 10.97,35.15 10.97,27.64 9.14,25.81 7.32,25.81 | 7.32,25.81 6.91,25.81 6.1,24.99 6.1,20.73 6.5,20.32 v11.58,20.32 | v5.08,29.26 5.89,29.26 7.11,28.04 7.11,26.01 7.32,25.81

### Text on the board
bPlace: DAMP | vALPHA | Designed By: | Travis E